# EasyEDA Pro project ProDoc_PCB1_2026-02-06.epro

# Board PCB1
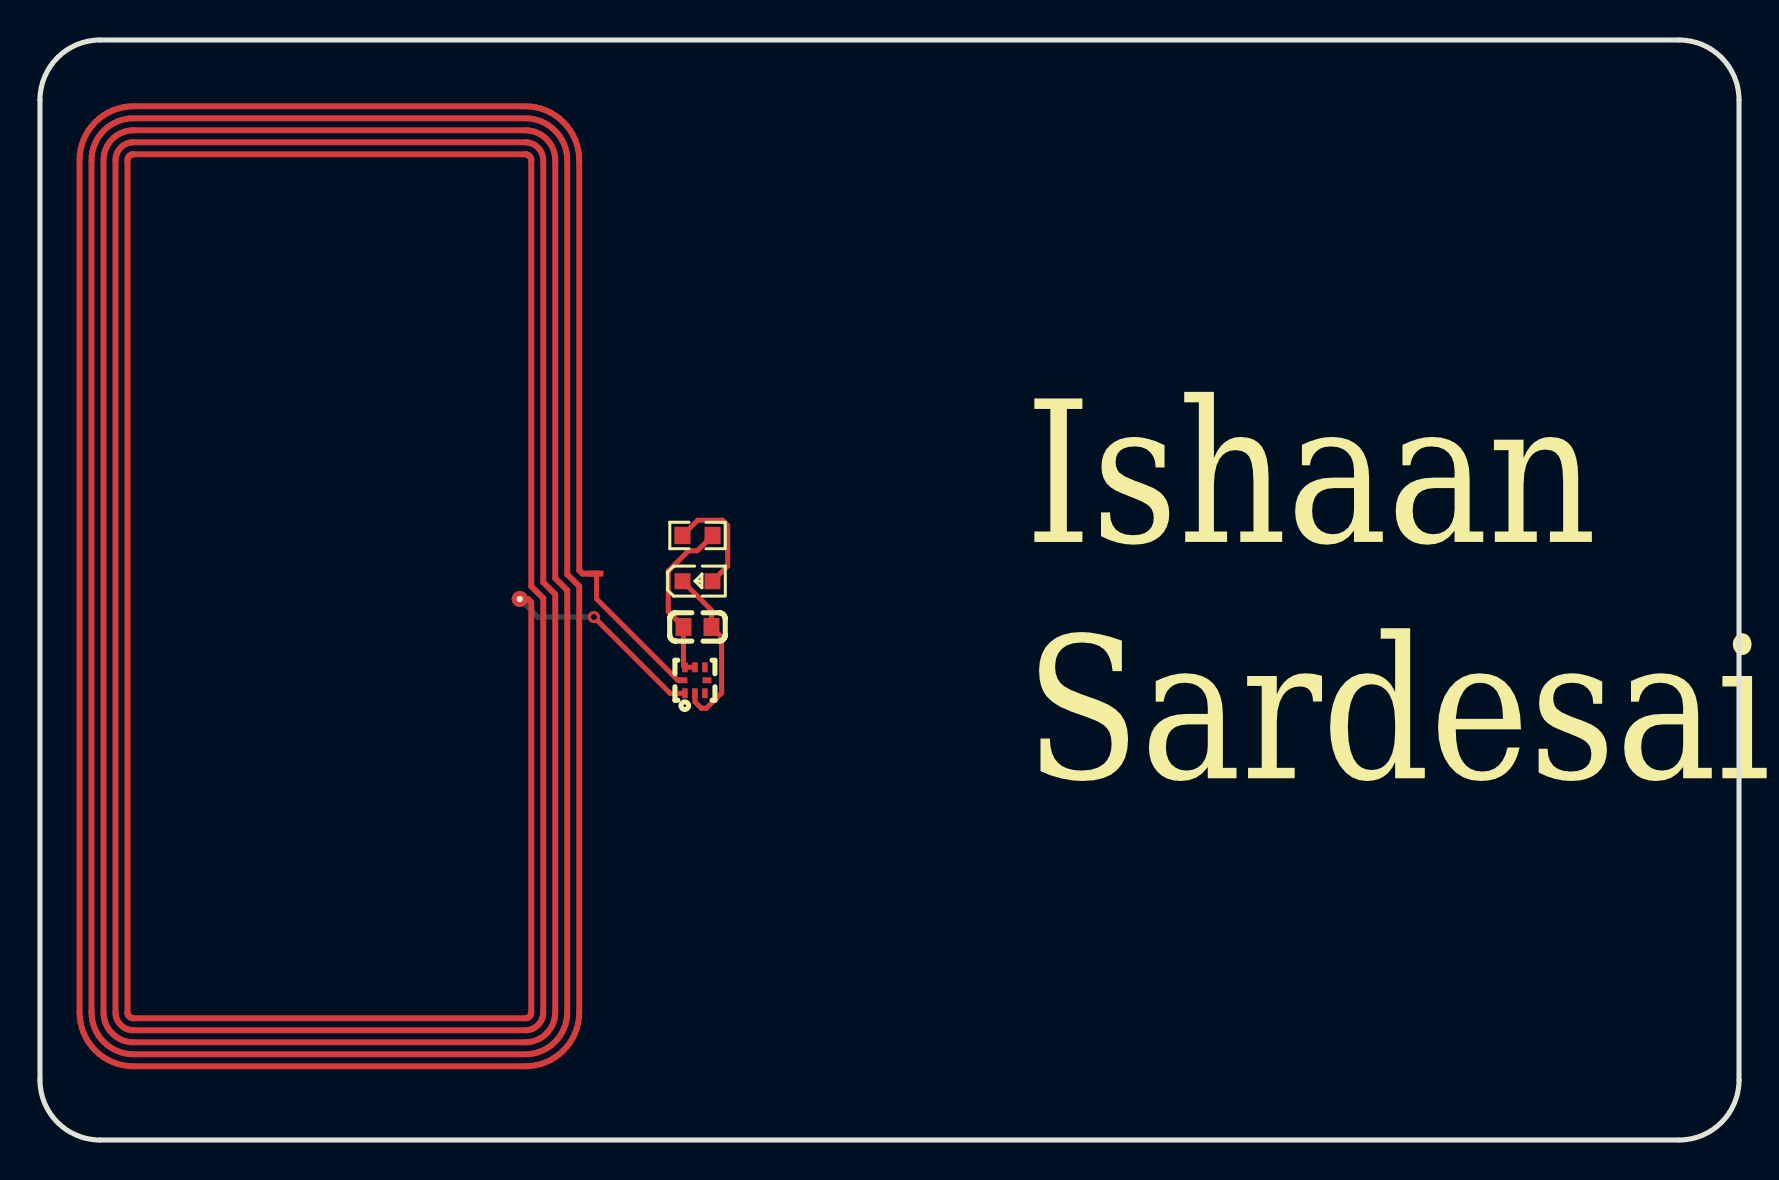
[diagram p0: board, top side]
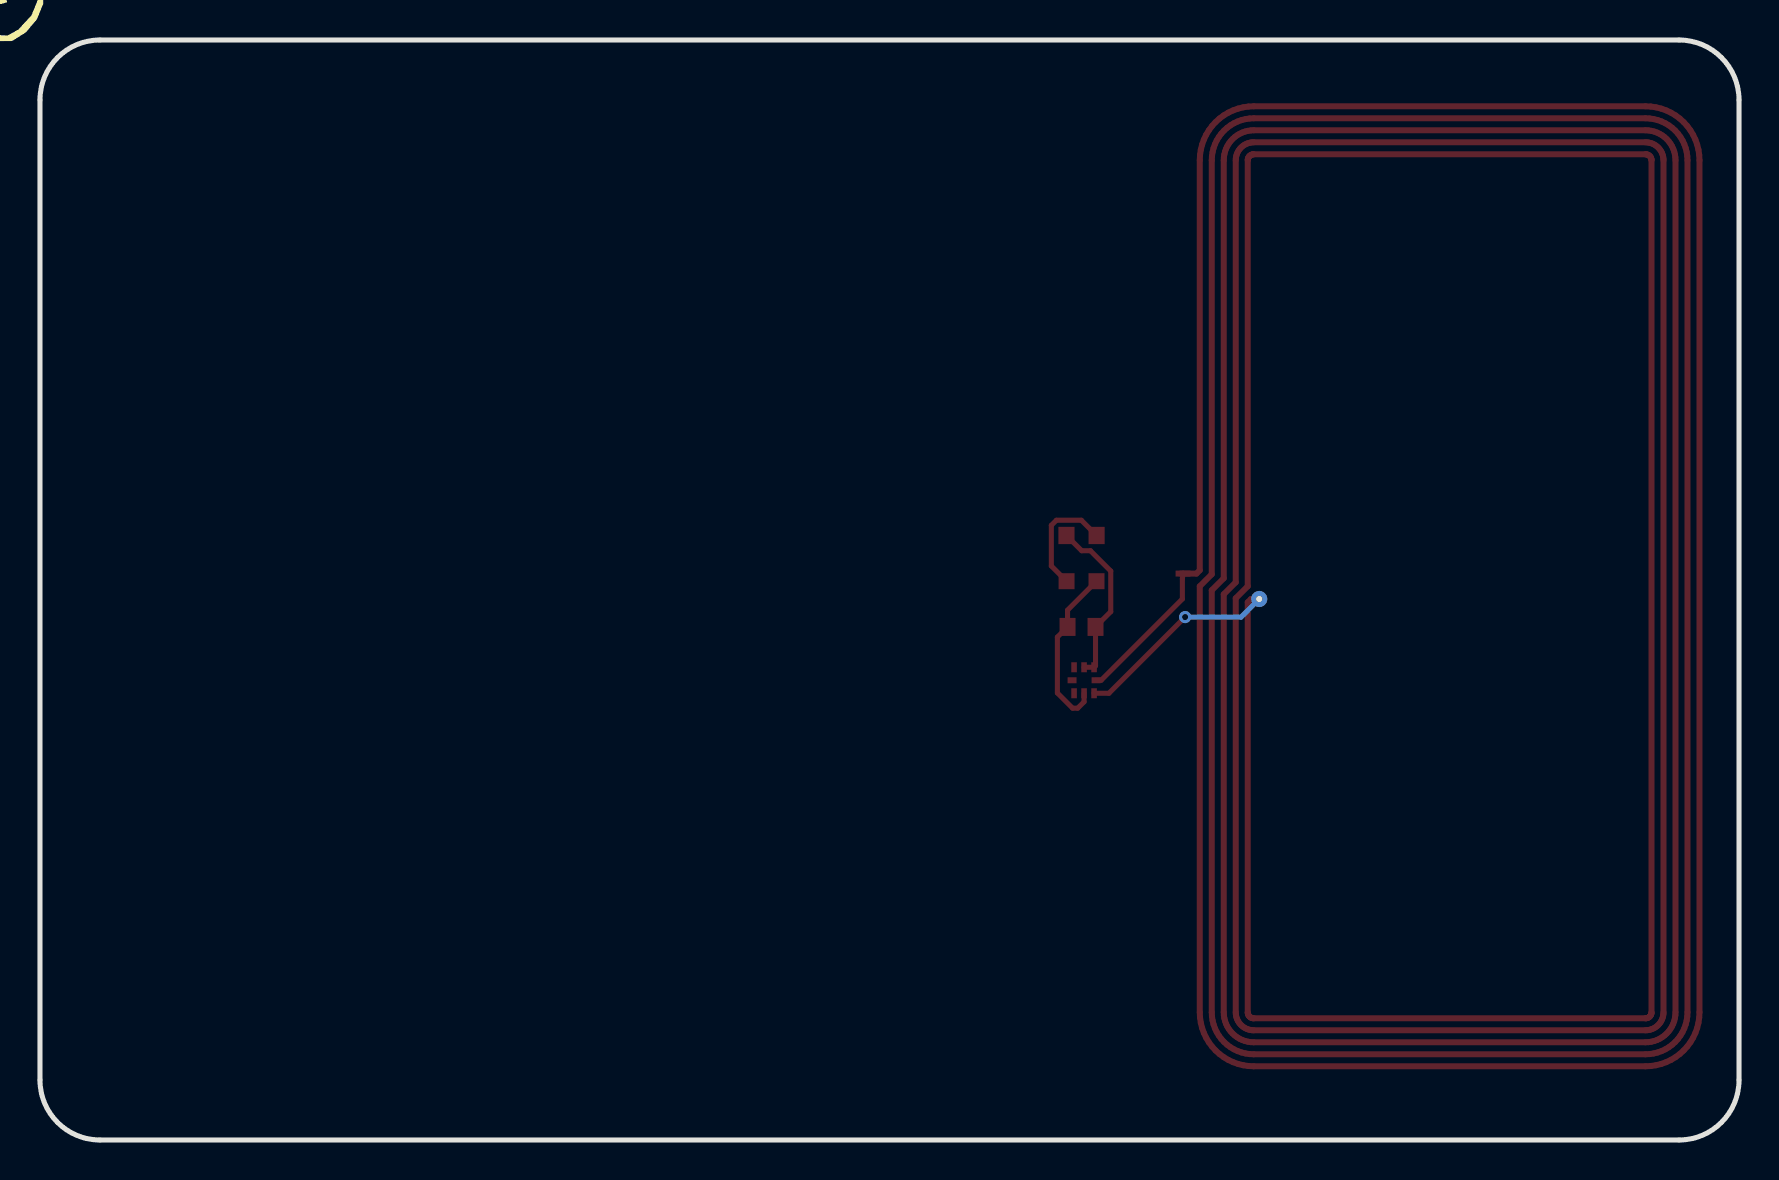
[diagram p1: board, bottom side, seen from below]

Outline 85 x 55 mm; copper layers: Top Layer, Bottom Layer. Coordinates in mm from the lower left corner of the outline.
Outline path: 0,52 0,3 arc(0.88,0.88) 3,0 82,0 arc(84.12,0.88) 85,3 85,52 arc(84.12,54.12) 82,55 3,55 arc(0.88,54.12) 0,52
Stack: Top Layer 0.035mm / Dielectric1 1.51mm FR4 er 4.5 / Bottom Layer 0.035mm

## Design rules (mm)
template: JLCPCB Capability(Two Layers Board)
spacing copperThickness1oz (default): track to track 0.102, other pairs 0.152 to 0.3
spacing copperThickness2oz: track to track 0.203, other pairs 0.152 to 0.3
track width copperThickness1oz (default): min 0.127, default 0.254, max 2.54
track width copperThickness2oz: min 0.203, default 0.254, max 2.54
differential pair differentialPair (default): width min 0.127, default 0.254, max 2.54; gap min 0.152, default 0.152
via viaSize (default): diameter min 0.5, default 0.61, max 10; hole min 0.3, default 0.305, max 6.3

## Placement (name value [footprint] x y rotation side)
C1  220nF  [C0603]  32.89 25.65 0 top
LED1  KT-0603R  [LED0603-RD]  32.89 27.94 0 top
R1  47ohm  [R0603]  32.89 30.23 0 top
U1  13.56MHz  [XQFN-8_L1.6-W1.6-P0.50-BL_NT3H2111W0FHKH]  32.77 22.99 0 top
U2  -  [25X48MM_NFC_ANTENNA]  14.48 27.69 270 top

## Footprints (pads in the part's own frame, mm; a bottom-side part is the same pattern mirrored in y, then rotated)
25X48MM_NFC_ANTENNA
  rect 0.3x0.75 smd: P$1(-0.635,13.335)
  round 0.808 hole 0.3: P$2(0.635,9.525)
C0603
  rect 0.8x0.9 smd: 1(-0.7,0) 2(0.7,0)
LED0603-RD
  rect 0.8x0.8 smd: 1(-0.749,0) 2(0.749,0)
R0603
  rect 0.806x0.864 smd: 1(-0.753,0) 2(0.753,0)
XQFN-8_L1.6-W1.6-P0.50-BL_NT3H2111W0FHKH
  rect 0.28x0.5 smd: 1(-0.5,-0.65) 2(0,-0.65) 3(0.5,-0.65) 5(0.5,0.65) 6(0,0.65) 7(-0.5,0.65)
  rect 0.45x0.3 smd: 4(0.6,0) 8(-0.6,0)

## Nets
$1N314: C1.1 R1.2 U1.6 U1.7
$1N320: LED1.2 R1.1
$1N325: C1.2 LED1.1 U1.2
$1N484: U1.1 U2.P$2
$1N489: U1.8 U2.P$1

Pads without a net: U1 3 4 5

## Via types
v1: diameter 0.61, hole 0.305, Top Layer to Bottom Layer, 1 via

## Routing (per net, layer and track width the routed paths; a pad name or vN(x,y) marks a point on that pad's centre or on a via; arc(x,y) is an arc through that point)
$1N314: length 8.6
  Top Layer w0.254: R1.2 32.88,29.46 32.45,29.46 31.43,28.45 31.43,26.42 C1.1 32.19,23.71 32.27,23.64 32.77,23.64
$1N320: length 5.8
  Top Layer w0.254: LED1.2 34.4,28.7 34.4,30.73 34.15,30.99 32.9,30.99 R1.1
$1N325: length 8.6
  Top Layer w0.254: LED1.1 33.59,26.49 C1.2 34.1,25.15 34.1,22.35 33.34,21.59 33.08,21.59 32.77,21.91 U1.2
$1N484: length 10.2
  Top Layer w0.254: U1.1 31.52,22.34 v1(27.71,26.15)
  Bottom Layer w0.254: U2.P$2 24.91,26.15 v1(27.71,26.15)
$1N489: length 7.3
  Top Layer w0.254: U1.8 31.91,22.99 27.85,27.05 27.85,28.07 27.81,28.32

## Text on the board
Top Silkscreen Layer: Ishaan / Sardesai
